# EAGLE design R002B (EAGLE 6.6.0)
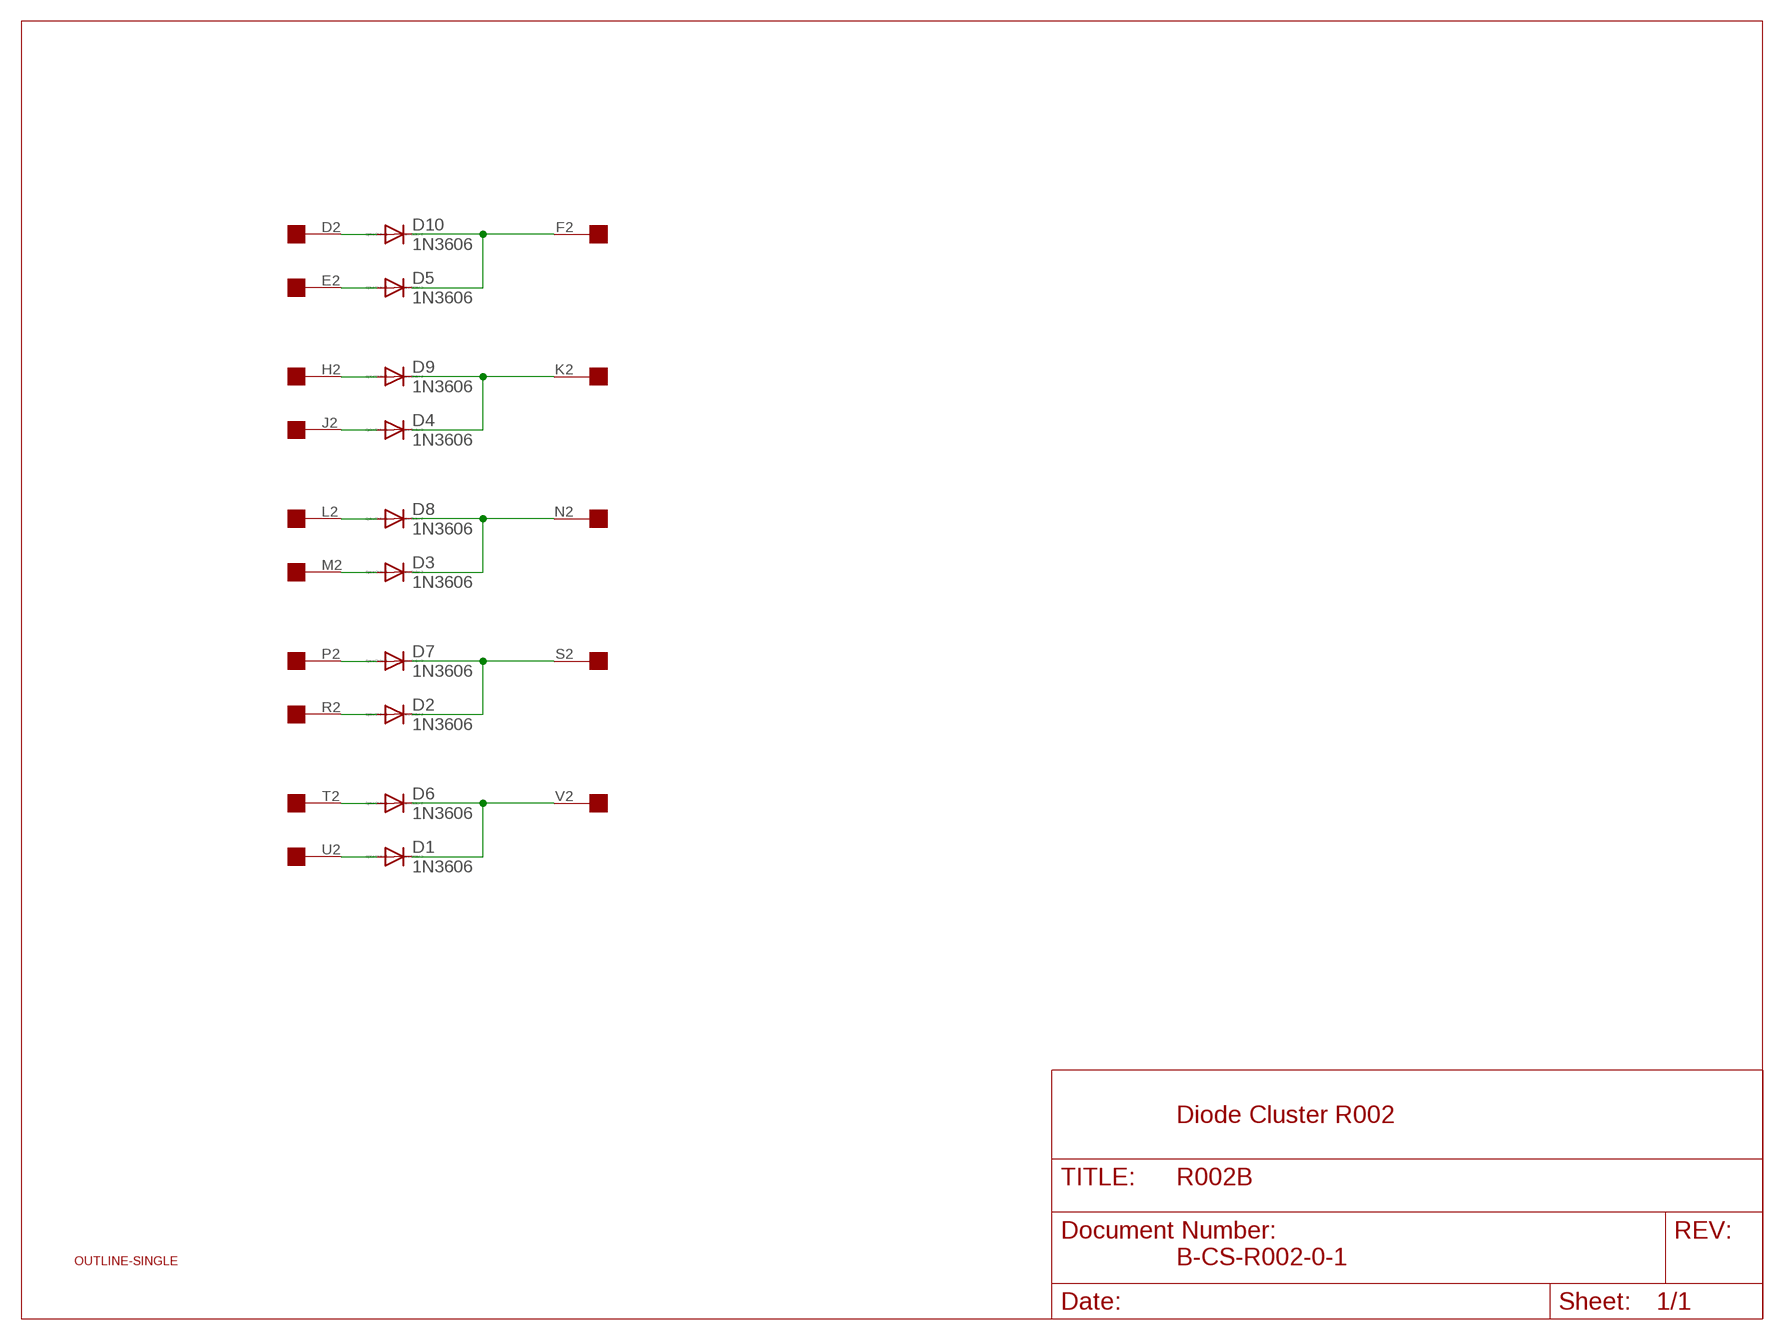
[diagram p0: schematic, sheet 1]

## Parts
D1  1N3606  1N4148DO35-10  [DO35-10]
D2  1N3606  1N4148DO35-10  [DO35-10]
D3  1N3606  1N4148DO35-10  [DO35-10]
D4  1N3606  1N4148DO35-10  [DO35-10]
D5  1N3606  1N4148DO35-10  [DO35-10]
D6  1N3606  1N4148DO35-10  [DO35-10]
D7  1N3606  1N4148DO35-10  [DO35-10]
D8  1N3606  1N4148DO35-10  [DO35-10]
D9  1N3606  1N4148DO35-10  [DO35-10]
D10  1N3606  1N4148DO35-10  [DO35-10]
U$1  OUTLINE-SINGLE  [SINGLE]
U$2  EDGE-1  [EDGE-CON1]

## Nets
N$1: D10.A U$2.D2
N$2: D5.A U$2.E2
N$3: D5.C D10.C U$2.F2
N$4: D9.A U$2.H2
N$5: D4.A U$2.J2
N$6: D4.C D9.C U$2.K2
N$7: D8.A U$2.L2
N$8: D3.A U$2.M2
N$9: D3.C D8.C U$2.N2
N$10: D7.A U$2.P2
N$11: D2.A U$2.R2
N$12: D2.C D7.C U$2.S2
N$13: D6.A U$2.T2
N$14: D1.A U$2.U2
N$15: D1.C D6.C U$2.V2
Unconnected: U$2.A2 U$2.B2 U$2.C2

## Notes on the sheet
- Diode Cluster R002
- B-CS-R002-0-1

## Library data of the parts
D1-D10 = diode:1N4148: DIODE high speed (Philips)
U$1 = dec-con:OUTLINE-*: Board outlines for DEC boards.
U$2 = dec-con:EDGE-1: Single-Sided DEC Edge Connector -- (side 2)

## Board
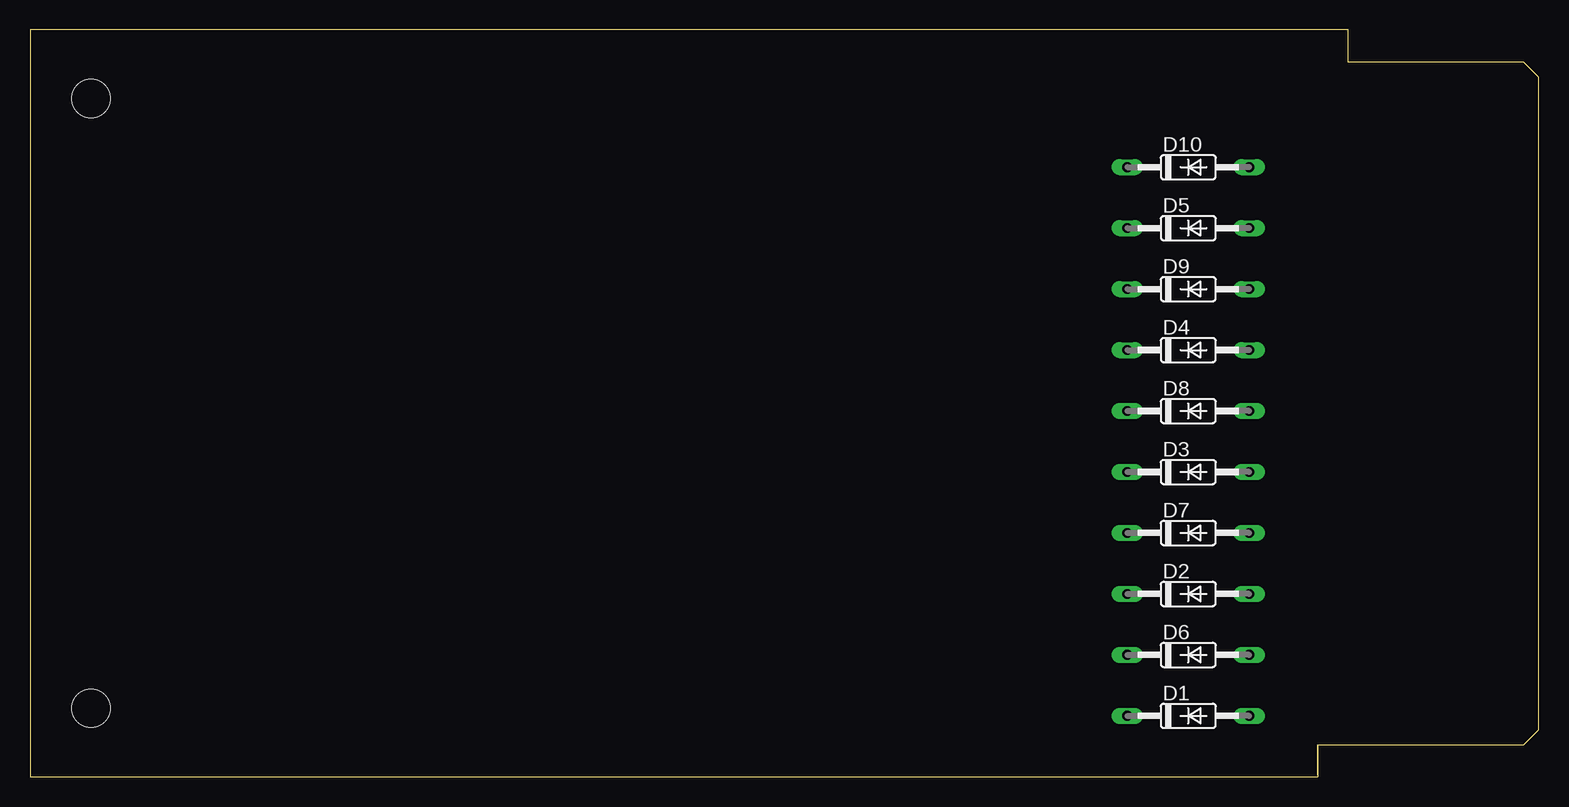
[diagram p1: board, top side]
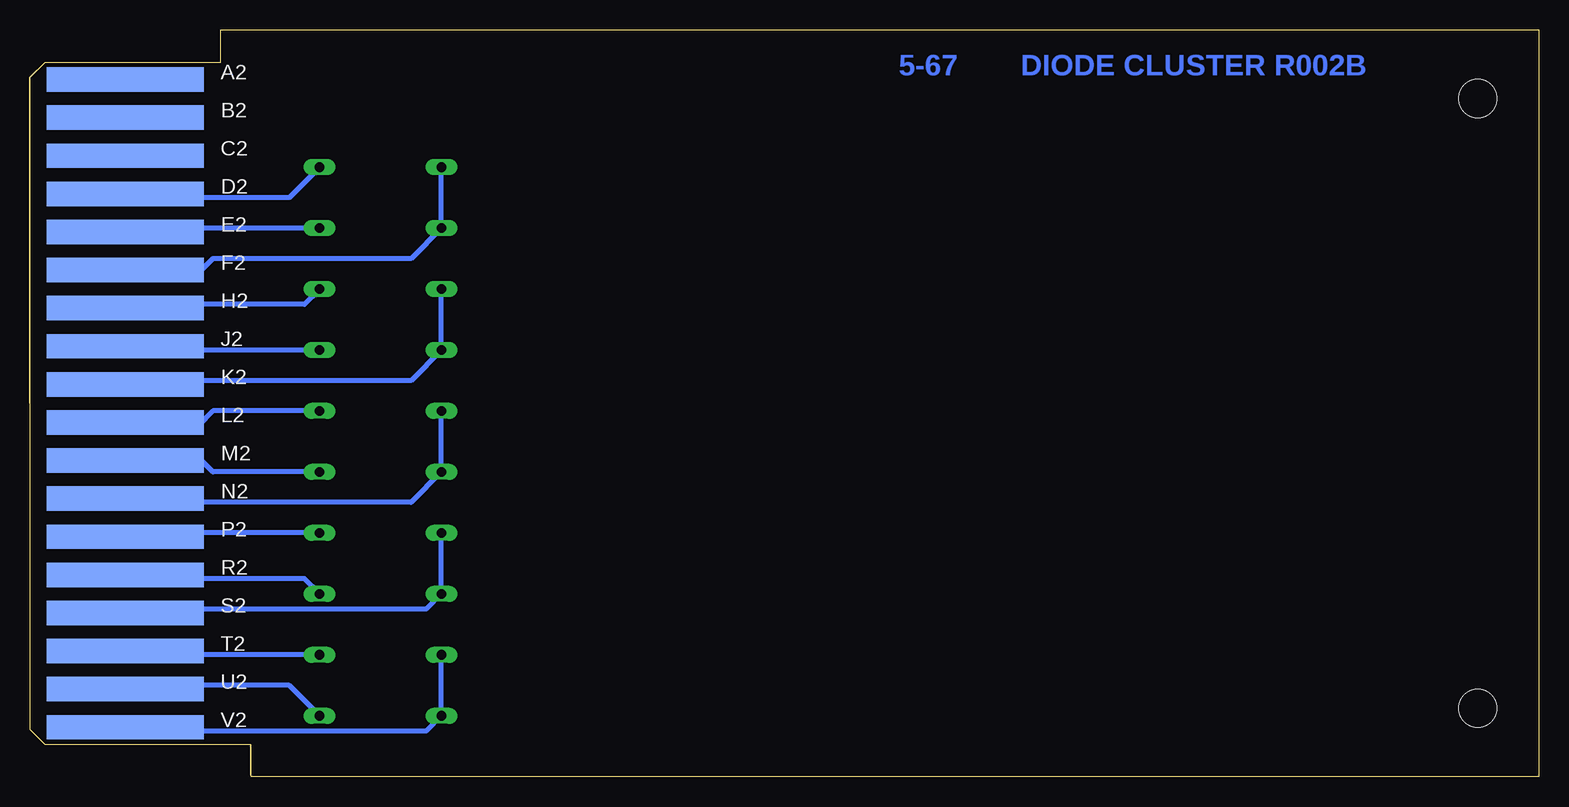
[diagram p2: board, bottom side, seen from below]

Size 125.73 x 62.23 mm. Coordinates in mm from the lower left corner, seen from the top.
Copper layers (1+16): Top 0.035mm / dielectric 1.5mm / Bottom 0.035mm
Design rules "16mils": minimum track width 16mil, minimum drill 32mil, track to track 15mil, track to pad 10mil, pad to pad 10mil, via to via 10mil, smd to smd 10mil, copper to edge 13mil, drill to drill 10mil, minimum pad ring 10mil, minimum via ring 8mil, stop-mask expansion 0mil, vias tented up to drill 0mil, thermal gap 10mil

### Footprints (pad centres in the part's own frame; a part is rotated, then mirrored left to right if it is on the bottom)
DO35-10 = drill 0.813 long: A 5.08,0; C -5.08,0
SINGLE = hole 3.175: 120.65,56.515; 120.65,5.715
EDGE-CON1 = smd 13.106 x 2.032 bottom: A2 7.938,4.128; B2 7.938,7.303; C2 7.938,10.477; D2 7.938,13.652; E2 7.938,16.828; F2 7.938,20.003; H2 7.938,23.177; J2 7.938,26.352; K2 7.938,29.527; L2 7.938,32.703; M2 7.938,35.877; N2 7.938,39.053; P2 7.938,42.227; R2 7.938,45.403; S2 7.938,48.578; T2 7.938,51.752; U2 7.938,54.928; V2 7.938,58.102

### Placement (x,y rotation side)
D1  96.52,5.08 0 top
D2  96.52,15.24 0 top
D3  96.52,25.4 0 top
D4  96.52,35.56 0 top
D5  96.52,45.72 0 top
D6  96.52,10.16 0 top
D7  96.52,20.32 0 top
D8  96.52,30.48 0 top
D9  96.52,40.64 0 top
D10  96.52,50.8 0 top
U$1  125.73,62.23 180 top
U$2  125.73,62.23 180 top

### Tracks (layer width: path | path; a pad name or v marks a point on that pad's centre or on a via)
N$1
  Bottom 0.406: D10.A 104.14,48.26 113.03,48.26 U$2.D2
N$2
  Bottom 0.406: D5.A 111.76,45.72 U$2.E2
N$3
  Bottom 0.406: D10.C D5.C 93.98,43.18 110.49,43.18 111.76,41.91 U$2.F2
N$4
  Bottom 0.406: D9.A 102.87,39.37 111.76,39.37 U$2.H2
N$5
  Bottom 0.406: D4.A 111.76,35.56 U$2.J2
N$6
  Bottom 0.406: D9.C D4.C 93.98,33.02 111.76,33.02 U$2.K2
N$7
  Bottom 0.406: D8.A 110.49,30.48 111.76,29.21 U$2.L2
N$8
  Bottom 0.406: D3.A 110.49,25.4 111.76,26.67 U$2.M2
N$9
  Bottom 0.406: D8.C D3.C 93.98,22.86 111.76,22.86 U$2.N2
N$10
  Bottom 0.406: D7.A 111.76,20.32 U$2.P2
N$11
  Bottom 0.406: D2.A 102.87,16.51 111.76,16.51 U$2.R2
N$12
  Bottom 0.406: D7.C D2.C 92.71,13.97 111.76,13.97 U$2.S2
N$13
  Bottom 0.406: D6.A 111.76,10.16 U$2.T2
N$14
  Bottom 0.406: D1.A 104.14,7.62 113.03,7.62 U$2.U2
N$15
  Bottom 0.406: D6.C D1.C 92.71,3.81 111.76,3.81 U$2.V2

### Text on the board
Bottom: DIODE CLUSTER R002B | 5-67